# Altium schematic sheet Power Supply for CPU Blocks.SchDoc: RK3399 COB Design V1.0
size A3; Author: ABC; Organization: Altium Limited; Address1: L3, 12a Rodborough Rd; Address2: Frenchs Forest; Address3: NSW; Address4: Australia 2086; DocumentNumber: 16; SheetNumber: 16; SheetTotal: 27; PROJECT CODE: A_V1.0
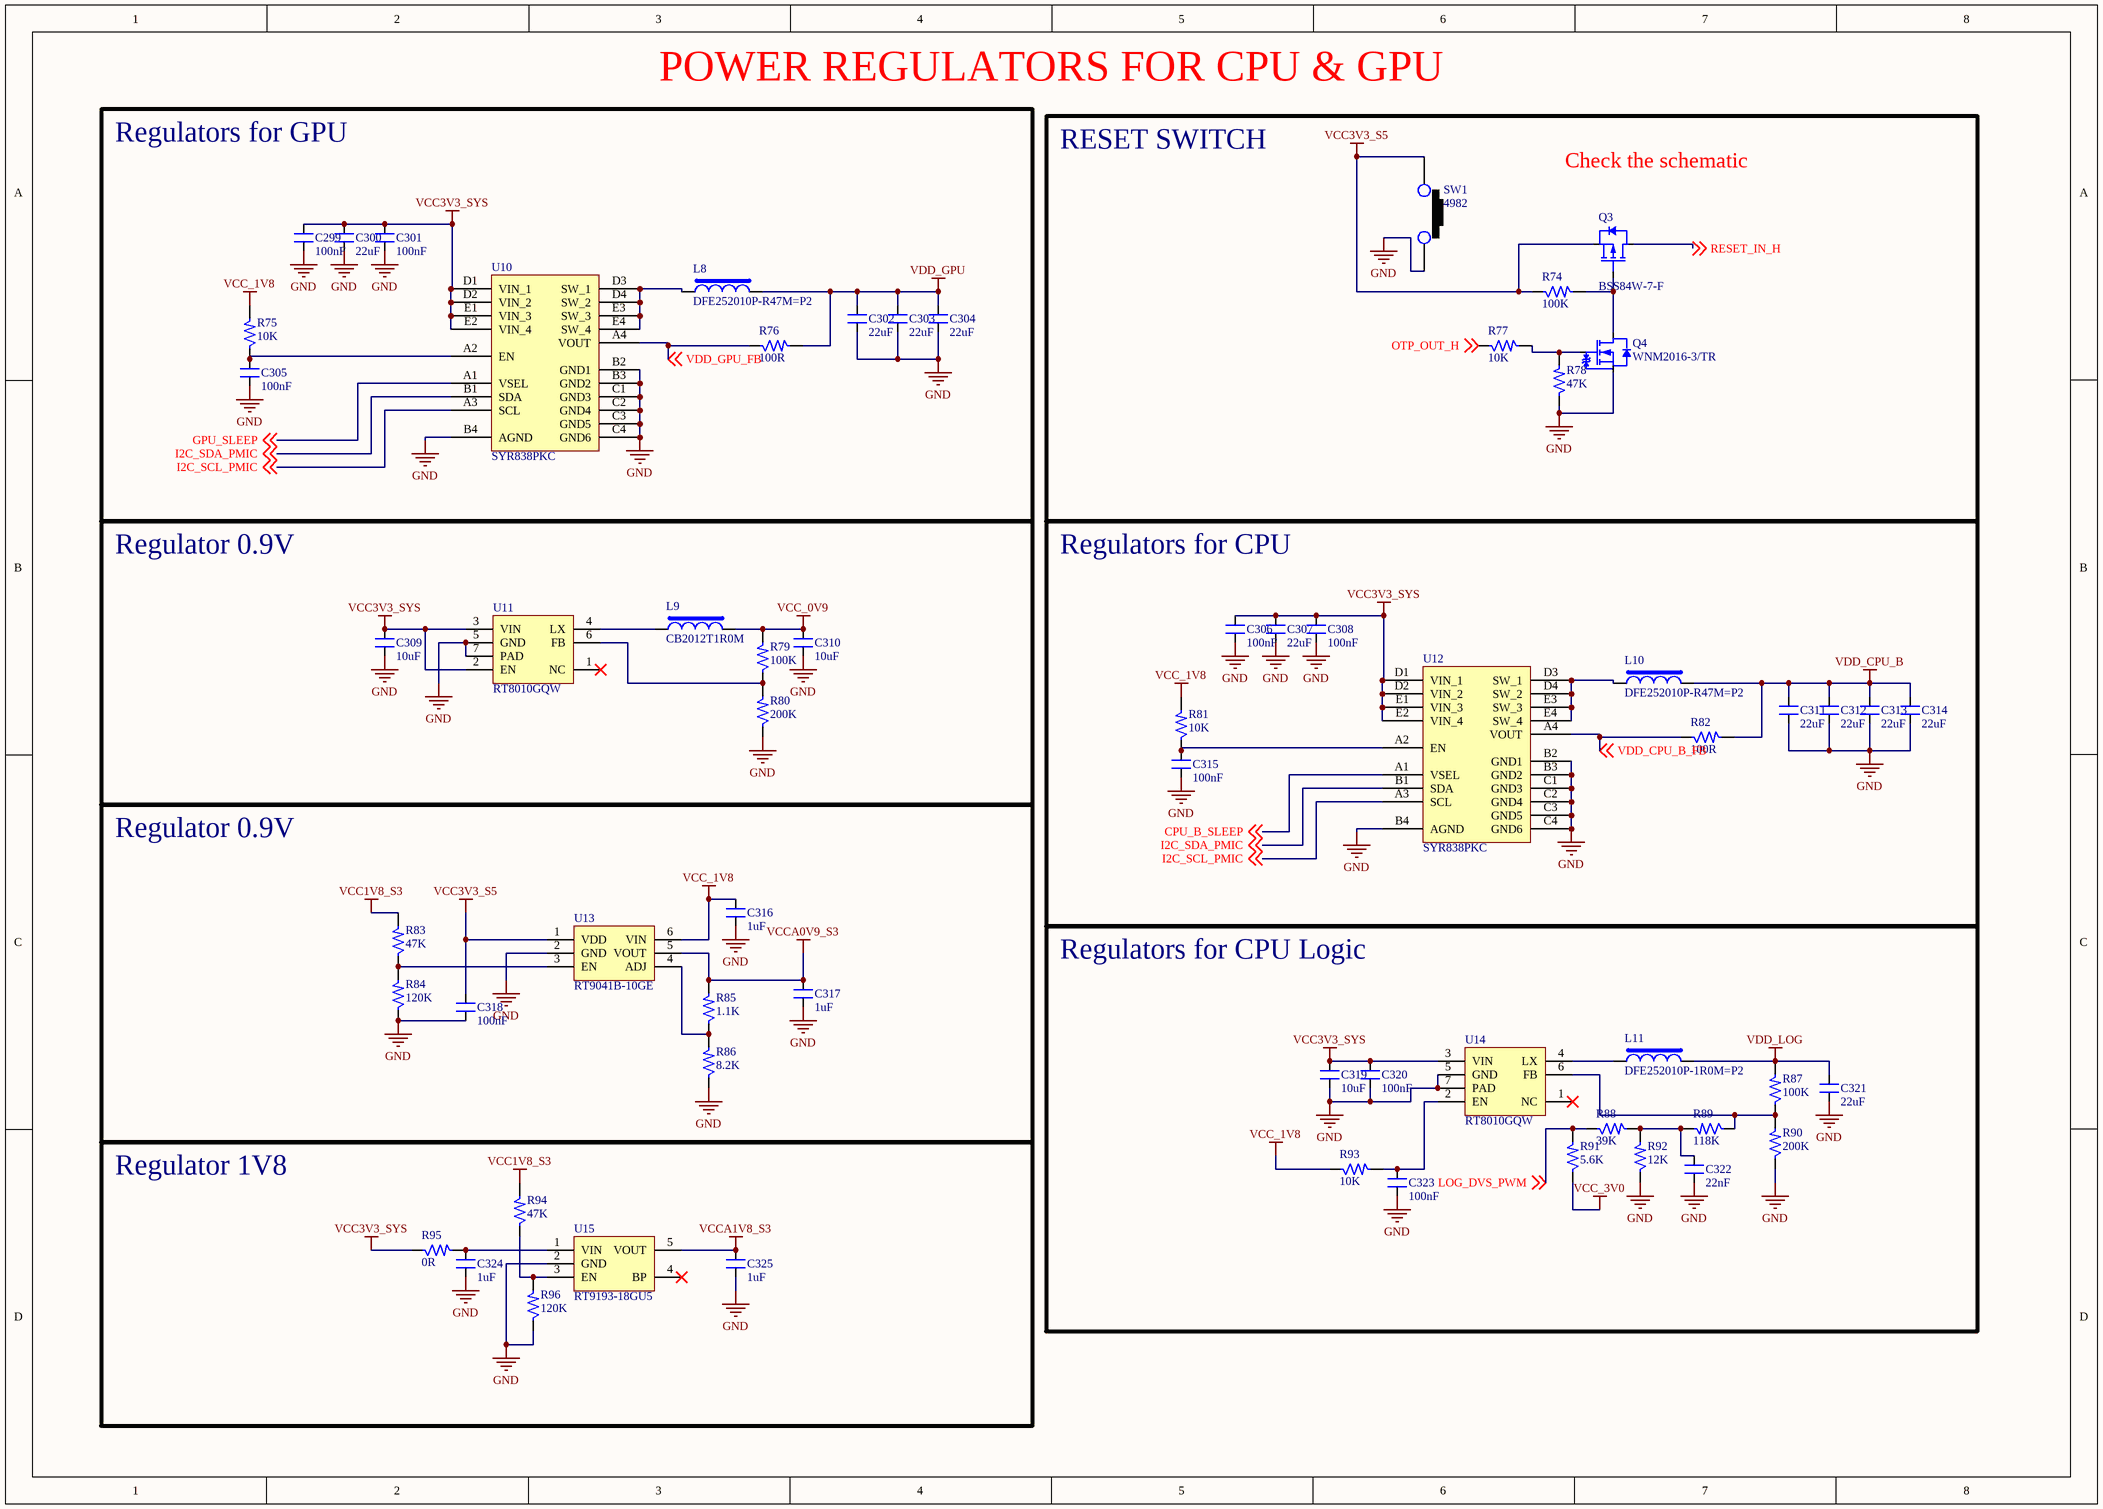
[diagram p0: Power Supply for CPU Blocks.SchDoc]

## Parts
C299  100nF  [CAP_0603]
C300  22uF  [CAP_0603]
C301  100nF  [CAP_0603]
C302  22uF  [CAP_0805]
C303  22uF  [CAP_0805]
C304  22uF  [CAP_0805]
C305  100nF  [CAP_0603]
C306  100nF  [CAP_0603]
C307  22uF  [CAP_0603]
C308  100nF  [CAP_0603]
C309  10uF  [CAP_0603]
C310  10uF  [CAP_0603]
C311  22uF  [CAP_0805]
C312  22uF  [CAP_0805]
C313  22uF  [CAP_0805]
C314  22uF  [CAP_0805]
C315  100nF  [CAP_0603]
C316  1uF  [CAP_0603]
C317  1uF  [CAP_0603]
C318  100nF  [CAP_0603]
C319  10uF  [CAP_0603]
C320  100nF  [CAP_0603]
C321  22uF  [CAP_0603]
C322  22nF  [CAP_0603]
C323  100nF  [CAP_0603]
C324  1uF  [CAP_0603]
C325  1uF  [CAP_0603]
L8  DFE252010P-R47M=P2  [IND_1008]
L9  CB2012T1R0M  [IND_0805]
L10  DFE252010P-R47M=P2  [IND_1008]
L11  DFE252010P-1R0M=P2  [IND_1008]
Q3  BSS84W-7-F  [SOT-323-3]
Q4  WNM2016-3/TR  [SOT 23-3]
R74  100K  [RES_0603]
R75  10K  [RES_0603]
R76  100R  [RES_0603]
R77  10K  [RES_0603]
R78  47K  [RES_0603]
R79  100K  [RES_0603]
R80  200K  [RES_0603]
R81  10K  [RES_0603]
R82  100R  [RES_0603]
R83  47K  [RES_0603]
R84  120K  [RES_0603]
R85  1.1K  [RES_0603]
R86  8.2K  [RES_0603]
R87  100K  [RES_0603]
R88  39K  [RES_0603]
R89  118K  [RES_0603]
R90  200K  [RES_0603]
R91  5.6K  [RES_0603]
R92  12K  [RES_0603]
R93  10K  [RES_0603]
R94  47K  [RES_0603]
R95  0R  [RES_0603]
R96  120K  [RES_0603]
SW1  4982  [SW_177_39.3X77.7_SMD]
U10  SYR838PKC  [CSP20_15.7_100x84_SMD]
U11  RT8010GQW  [WDFN-6_26_133X100_SMD]
U12  SYR838PKC  [CSP20_15.7_100x84_SMD]
U13  RT9041B-10GE  [SOT23-6]
U14  RT8010GQW  [WDFN-6_26_133X100_SMD]
U15  RT9193-18GU5  [SOT23-5]

## Blocks framed on the sheet
POWER REGULATORS FOR CPU & GPU: C299-C305 L8 R75 R76 U10
RESET SWITCH: Q3 Q4 R74 R77 R78 SW1
Regulator 0.9V: C309 C310 L9 R79 R80 U11
Regulators for CPU: C306-C308 C311-C315 L10 R81 R82 U12
Regulator 0.9V: C316-C318 R83-R86 U13
Regulators for CPU Logic: C319-C323 L11 R87-R93 U14
Regulator 1V8: C324 C325 R94-R96 U15

## Nets
GND: C299.1 C300.1 C301.1 C302.1 C303.1 C304.1 C305.1 C306.1 C307.1 C308.1 C309.1 C310.1 C311.1 C312.1 C313.1 C314.1 C315.1 C316.1 C317.1 C318.1 C319.1 C320.1 C321.1 C322.1 C323.1 C324.1 C325.1 Q4.2(S) R78.1 R80.1 R84.1 R86.1 R90.1 R92.1 R96.1 SW1.2 U10.B2(GND1) U10.B3(GND2) U10.B4(AGND) U10.C1(GND3) U10.C2(GND4) U10.C3(GND5) U10.C4(GND6) U11.5(GND) U11.7(PAD) U12.B2(GND1) U12.B3(GND2) U12.B4(AGND) U12.C1(GND3) U12.C2(GND4) U12.C3(GND5) U12.C4(GND6) U13.2(GND) U14.5(GND) U14.7(PAD) U15.2(GND)
VCC1V8_S3: R83.2 R94.2
VCC3V3_S5: C318.2 Q3.2(S) R74.1 SW1.1 U13.1(VDD)
VCC3V3_SYS: C299.2 C300.2 C301.2 C306.2 C307.2 C308.2 C309.2 C319.2 C320.2 R95.1 U10.D1(VIN_1) U10.D2(VIN_2) U10.E1(VIN_3) U10.E2(VIN_4) U11.2(EN) U11.3(VIN) U12.D1(VIN_1) U12.D2(VIN_2) U12.E1(VIN_3) U12.E2(VIN_4) U14.3(VIN)
VCC_0V9: C310.2 L9.2 R79.2
VCC_1V8: C316.2 R75.2 R81.2 R93.1 U13.6(VIN)
VCC_3V0: R91.1
VCCA0V9_S3: C317.2 R85.2 U13.5(VOUT)
VCCA1V8_S3: C325.2 U15.5(VOUT)
VDD_CPU_B: C311.2 C312.2 C313.2 C314.2 L10.2 R82.2
VDD_GPU: C302.2 C303.2 C304.2 L8.2 R76.2
VDD_LOG: C321.2 L11.2 R87.2
CPU_B_SLEEP: U12.A1(VSEL) ; off-sheet CPU_B_SLEEP
GPU_SLEEP: U10.A1(VSEL) ; off-sheet GPU_SLEEP
I2C_SCL_PMIC: U10.A3(SCL) U12.A3(SCL) ; off-sheet I2C_SCL_PMIC
I2C_SDA_PMIC: U10.B1(SDA) U12.B1(SDA) ; off-sheet I2C_SDA_PMIC
LOG_DVS_PWM: R88.1 R91.2 ; off-sheet LOG_DVS_PWM
OTP_OUT_H: R77.1 ; off-sheet OTP_OUT_H
RESET_IN_H: Q3.3(D) ; off-sheet RESET_IN_H
VDD_CPU_B_FB: R82.1 U12.A4(VOUT) ; off-sheet VDD_CPU_B_FB
VDD_GPU_FB: R76.1 U10.A4(VOUT) ; off-sheet VDD_GPU_FB
NetC305_2: C305.2 R75.1 U10.A2(EN)
NetC315_2: C315.2 R81.1 U12.A2(EN)
NetC322_2: C322.2 R88.2 R89.2 R92.2
NetC323_2: C323.2 R93.2 U14.2(EN)
NetC324_2: C324.2 R95.2 U15.1(VIN)
NetL8_1: L8.1 U10.D3(SW_1) U10.D4(SW_2) U10.E3(SW_3) U10.E4(SW_4)
NetL9_1: L9.1 U11.4(LX)
NetL10_1: L10.1 U12.D3(SW_1) U12.D4(SW_2) U12.E3(SW_3) U12.E4(SW_4)
NetL11_1: L11.1 U14.4(LX)
NetQ3_1: Q3.1(G) Q4.3(D) R74.2
NetQ4_1: Q4.1(G) R77.2 R78.2
NetR79_1: R79.1 R80.2 U11.6(FB)
NetR83_1: R83.1 R84.2 U13.3(EN)
NetR85_1: R85.1 R86.2 U13.4(ADJ)
NetR87_1: R87.1 R89.1 R90.2 U14.6(FB)
NetR94_1: R94.1 R96.2 U15.3(EN)

Not connected (* = marked no-connect by the designer): U11 1(NC)*; U14 1(NC)*; U15 4(BP)*

## Notes on the sheet
- Regulators for GPU
- Check the schematic
- TITLE:
- DOCUMENT NAME:
- SCALE 1:1
- This document is copyright of Esteempcb and shall not be revealed, produced, copied, in whole or in part, nor
- PROJECT CODE:
- TEMPLATE:
- A3
- AUTHOR:
- Sheet
- of
- used for any purpose other than submitted.

## Library data of the parts
C299 C301 C305 C306 C308 C315 C318 C320 C323 = CAP_100nF-10V-5%-0603: 0.1µF ±10% 10V Ceramic Capacitor X7R 0603 (1608 Metric) /; Manufacturer: Yageo; Manufacturer Part Number: CC0603KRX7R6BB104; Case/Package: 0603; Supplier-1: Digikey
C300 C307 C321 = CAP_22uF-10V-20%-0603: 22µF ±20% 10V Ceramic Capacitor X5R 0603 (1608 Metric) /; Manufacturer: Murata Electronics; Manufacturer Part Number: GRM188R61A226ME15D; Case/Package: 0603; Supplier-1: Digikey
C302-C304 C311-C314 = CAP_22uF-25V-20%-0805: 22µF ±20% 25V Ceramic Capacitor X5R 0805 (2012 Metric) /; Manufacturer: Murata Electronics; Manufacturer Part Number: GRM21BR61E226ME44K; Case/Package: 0805; Supplier-1: Digikey
C309 C310 C319 = CAP_10uF-10V-10%-0603: 10µF ±10% 10V Ceramic Capacitor X5R 0603 (1608 Metric) /; Manufacturer Part Number: GRM188R61A106KE69J; Manufacturer: Murata Electronics; Case/Package: 0603; Supplier-1: Digikey
C316 C317 C324 C325 = CAP_1uF-10V-5%-0603: 1µF ±10% 10V Ceramic Capacitor X5R 0603 (1608 Metric) /; Manufacturer: Samsung Electro-Mechanics; Manufacturer Part Number: CL10A105KP8NNNC; Case/Package: 0603; Supplier-1: Digikey
C322 = CAP_22nF-10V-10%-0603: 0.022µF ±10% 10V Ceramic Capacitor X7R 0603 (1608 Metric) /; Manufacturer Part Number: LMF107B7223KAHT; Manufacturer: Taiyo Yuden; Case/Package: 0603; Supplier-1: Digikey
L8 L10 = IND_470nH-5A-20%-1008: 470nH Shielded Wirewound Inductor 5A 35mOhm Max 1008 (2520 Metric); Manufacturer: Murata Electronics; Manufacturer Part Number: DFE252010P-R47M=P2; Case/Package: 1008; Supplier-1: Digikey
L9 = IND_1uF-0.5A-20%-0805: 1uH ±20% 500mA 150mΩ 0805 Inductors (SMD) RoHS /; Manufacturer: Taiyo Yuden; Manufacturer Part Number: CB2012T1R0M; Case/Package: 0805; Supplier-1: LCSC
L11 = IND_1uH-3.8A-20%-1008: 1µH Shielded Wirewound Inductor 3.8A 54mOhm Max 1008 (2520 Metric) /; Manufacturer: Murata Electronics; Manufacturer Part Number: DFE252010P-1R0M=P2; Case/Package: 1008; Supplier-1: Digikey
Q3 = MOSFET-P_50V-130mA-SOT-323: P-Channel 50V 130mA (Ta) 200mW (Ta) Surface Mount SOT-323; Manufacturer: Diodes Incorporated; Manufacturer Part Number: BSS84W-7-F; Case/Package: SOT-323; Supplier-1: Digikey
Q4 = MOSFET-N_20V-2.9A-SOT-23: N Channel 20V 2.9A 1V @ 250uA 47mΩ @ 3.6A,4.5V 700mW SOT-23(SOT-23-3) MOSFET RoHS /; Manufacturer: WILLSEMI(Will Semicon); Manufacturer Part Number: WNM2016-3/TR; Case/Package: SOT-23(SOT-23-3); Supplier-1: LCSC
R74 R79 R87 = RES_100K-0.1W-1%-0603: 100 kOhms ±1% 0.1W, 1/10W Chip Resistor 0603 (1608 Metric) Automotive AEC-Q200 Thick Film /; Manufacturer: tackpole Electronics Inc; Manufacturer Part Number: RMCF0603FT100K; Case/Package: 0603; Supplier-1: Digikey
R75 R77 R81 R93 = RES_10K-0.1W-1%-0603: 10 kOhms ±1% 0.1W, 1/10W Chip Resistor 0603 (1608 Metric) Thick Film /; Manufacturer: Yageo; Manufacturer Part Number: RC0603FR-0710KL; Case/Package: 0603; Supplier-1: Digikey
R76 R82 = RES_100R-0.1W-1%-0603: 100 Ohms ±1% 0.1W, 1/10W Chip Resistor 0603 (1608 Metric) Thick Film /; Manufacturer: Yageo; Manufacturer Part Number: RC0603FR-07100RL; Case/Package: 0603; Supplier-1: Digikey
R78 R83 R94 = RES_47K-0.1W-1%-0603: 47 kOhms ±1% 0.1W, 1/10W Chip Resistor 0603 (1608 Metric) Thick Film /; Manufacturer: Yageo; Manufacturer Part Number: RC0603FR-0747KL; Case/Package: 0603; Supplier-1: Digikey
R80 R90 = RES_200K-0.1W-1%-0603: 200 kOhms ±1% 0.1W, 1/10W Chip Resistor 0603 (1608 Metric) Thick Film /; Manufacturer: Yageo; Manufacturer Part number: RC0603FR-07200KL; Case/Package: 0603; Supplier-1: Digikey
R84 R96 = RES_120K-0.1W-1%-0603: 120 kOhms ±1% 0.1W, 1/10W Chip Resistor 0603 (1608 Metric) Thin Film /; Manufacturer: Yageo; Manufacturer Part Number: RT0603FRE07120KL; Case/Package: 0603; Supplier-1: Digikey
R85 = RES_1.1K-0.1W-1%-0603: 47 kOhms ±1% 0.1W, 1/10W Chip Resistor 0603 (1608 Metric) Thick Film /; Manufacturer: Yageo; Manufacturer Part Number: RC0603FR-0747KL; Case/Package: 0603; Supplier-1: Digikey
R86 = RES_8.2K-0.1W-1%-0603: 8.2 kOhms ±1% 0.1W, 1/10W Chip Resistor 0603 (1608 Metric) Automotive AEC-Q200 Thick Film /; Manufacturer: Stackpole Electronics Inc; Manufacturer Part Number: RMCF0603FT8K20; Case/Package: 0603; Supplier-1: Digikey
R88 = RES_39K-0.1W-1%-0603: 39 kOhms ±1% 0.1W, 1/10W Chip Resistor 0603 (1608 Metric) Automotive AEC-Q200, Moisture Resistant Thick Film /; Manufacturer: TE Connectivity Passive Product; Manufacturer Part Number: CRGCQ0603F39K; Case/Package: 0603; Supplier-1: Digikey
R89 = RES_118K-0.1W-1%-0603: 118 kOhms ±1% 0.1W, 1/10W Chip Resistor 0603 (1608 Metric) Automotive AEC-Q200 Thick Film /; Manufacturer: Stackpole Electronics Inc; Manuafcturer Part Number: RMCF0603FT118K; Case/Package: 0603; Supplier-1: Digikey
R91 = RES_5.6K-0.1W-1%-0603: 5.6 kOhms ±1% 0.1W, 1/10W Chip Resistor 0603 (1608 Metric) Automotive AEC-Q200, Moisture Resistant Thick Film /; Manufacturer: TE Connectivity Passive Product; Manufacturer Part Number: CRGCQ0603F5K6; Case/Package: 0603; Supplier-1: Digikey
R92 = RES_12K-0.1W-1%-0603: 12 kOhms ±1% 0.1W, 1/10W Chip Resistor 0603 (1608 Metric) Thick Film /; Manufacturer: TE Connectivity Passive Product; Manufacturer Part Number: CRG0603F12K; Case/Package: 0603; Supplier-1: Digikey
R95 = RES_0R-0.1W-1%-0603: 0 Ohms Jumper 0.1W, 1/10W Chip Resistor 0603 (1608 Metric) Thick Film; Manufacturer: Yageo; Manufacturer Part Number: RC0603JR-070RL; Case/Package: 0603; Supplier-1: Digikey
SW1 = SW1_4982: Tactile Switch 3x4x2mm SMD 2-Pin; Manufacturer: NA; Manufacturer Part Number: NA; Case/Package: SMD; Supplier-1: Sunrom
U10 U12 = IC_SYR838PKC: Step-Down Positive Programmable 1 6A 2.4MHz CSP1.56*1.96-20 DC-DC Converters RoHS; Manufacturer: Silergy Corp; Manufacturer Part Number: SYR838PKC; Case/Package: CSP1.56*1.96-20; Supplier-1: LCSC
U11 U14 = REG-ADJ_5.5V-5.5V-1A-6-WDFN: Buck Switching Regulator IC Positive Adjustable 0.6V 1 Output 1A 6-WDFN Exposed Pad; Manufacturer: Richtek USA Inc.; Manufacturer Part Number: RT8010GQW; Case/Package: 6-WDFN; Supplier-1: Digikey
U13 = REG-ADJ_5.5V-2.5V-0.5A-SOT-23-6: Linear Voltage Regulator IC 1 Output 500mA SOT-23-6; Manufacturer: Richtek USA Inc.; Manufacturer Part Number: RT9041B-10GE; Case/Package: SOT-23-6; Supplier-1: Digikey
U15 = REG_1.8V-300mA-5.5V-SC70-5: Linear Voltage Regulator IC 1 Output 300mA SC-70-5; Manufacturer: Richtek USA Inc.; Manufacturer Part Number: RT9193-18GU5; Case/Package: SC70-5; Supplier-1: Digikey